# Altium schematic sheet Controller.SchDoc
size A; SheetNumber: 2; SheetTotal: 5
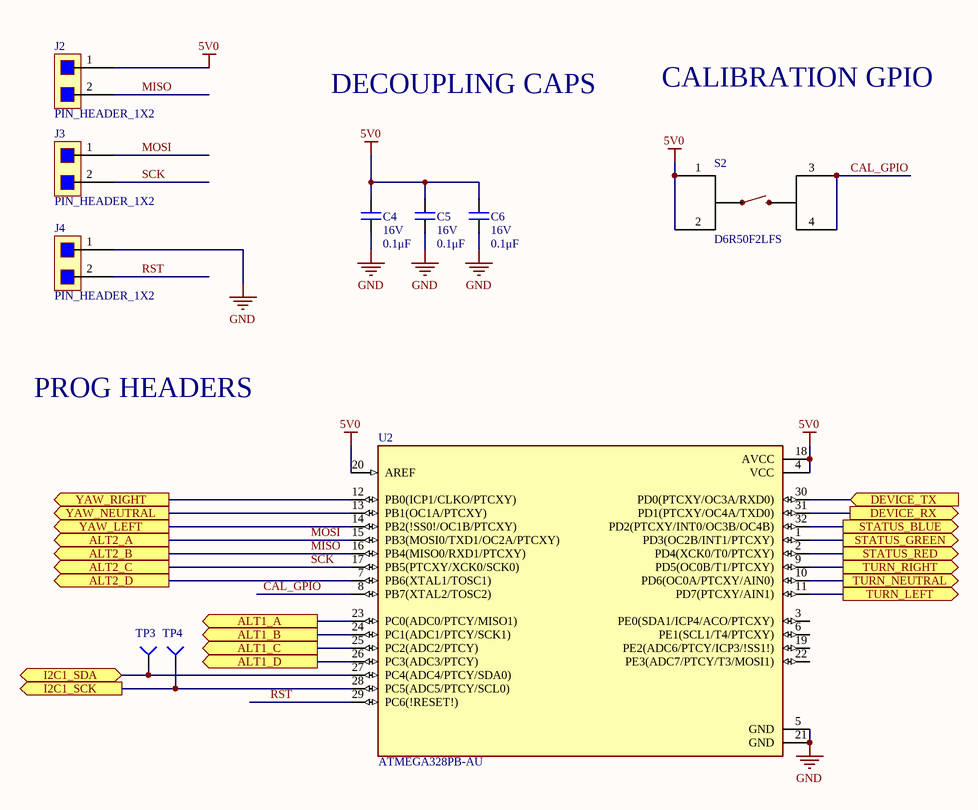
[diagram p0: Controller.SchDoc]

## Parts
C4  value 0.1μF  Voltage Rating: 16V  [CAP0603]  (hidden comment: CAP_0.1uF_16V_0603)
C5  value 0.1μF  Voltage Rating: 16V  [CAP0603]  (hidden comment: CAP_0.1uF_16V_0603)
C6  value 0.1μF  Voltage Rating: 16V  [CAP0603]  (hidden comment: CAP_0.1uF_16V_0603)
J2  PIN_HEADER_1X2  [PIN_HEADER - 1X2]
J3  PIN_HEADER_1X2  [PIN_HEADER - 1X2]
J4  PIN_HEADER_1X2  [PIN_HEADER - 1X2]
S2  Manufacturer Part Number 1: D6R50F2LFS  [D6R]  (hidden comment: SW_MOMENTARY_SPST)
TP3  TESTPT  [TESTPT SQUARE]  (value not drawn)
TP4  TESTPT  [TESTPT SQUARE]  (value not drawn)
U2  ATMEGA328PB-AU  [QFP80P900X900X120-32N]

## Ports
ALT1_A (out), ALT1_B (out), ALT1_C (out), ALT1_D (out), ALT2_A (out), ALT2_B (out), ALT2_C (out), ALT2_D (out), DEVICE_RX (out), DEVICE_TX (in), I2C1_SCK (out), I2C1_SDA (bidir), STATUS_BLUE (out), STATUS_GREEN (out), STATUS_RED (out), TURN_LEFT (out), TURN_NEUTRAL (out), TURN_RIGHT (out), YAW_LEFT (out), YAW_NEUTRAL (out), YAW_RIGHT (out)

## Nets
5V0: C4.2 C5.2 C6.2 J2.1 S2.1 S2.2 U2.4(VCC) U2.18(AVCC) U2.20(AREF)
GND: C4.1 C5.1 C6.1 J4.1 U2.5(GND) U2.21(GND)
ALT1_A: U2.23(PC0(ADC0/PTCY/MISO1)) ; port ALT1_A
ALT1_B: U2.24(PC1(ADC1/PTCY/SCK1)) ; port ALT1_B
ALT1_C: U2.25(PC2(ADC2/PTCY)) ; port ALT1_C
ALT1_D: U2.26(PC3(ADC3/PTCY)) ; port ALT1_D
ALT2_D: U2.7(PB6(XTAL1/TOSC1)) ; port ALT2_D
CAL_GPIO: S2.3 S2.4 U2.8(PB7(XTAL2/TOSC2))
DEVICE_RX: U2.31(PD1(PTCXY/OC4A/TXD0)) ; port DEVICE_RX
DEVICE_TX: U2.30(PD0(PTCXY/OC3A/RXD0)) ; port DEVICE_TX
I2C1_SCK: TP4.1(=value) U2.28(PC5(ADC5/PTCY/SCL0)) ; port I2C1_SCK
I2C1_SDA: TP3.1(=value) U2.27(PC4(ADC4/PTCY/SDA0)) ; port I2C1_SDA
MISO: J2.2 U2.16(PB4(MISO0/RXD1/PTCXY)) ; port ALT2_B
MOSI: J3.1 U2.15(PB3(MOSI0/TXD1/OC2A/PTCXY)) ; port ALT2_A
RST: J4.2 U2.29(PC6(!RESET!))
SCK: J3.2 U2.17(PB5(PTCXY/XCK0/SCK0)) ; port ALT2_C
STATUS_BLUE: U2.32(PD2(PTCXY/INT0/OC3B/OC4B)) ; port STATUS_BLUE
STATUS_GREEN: U2.1(PD3(OC2B/INT1/PTCXY)) ; port STATUS_GREEN
STATUS_RED: U2.2(PD4(XCK0/T0/PTCXY)) ; port STATUS_RED
TURN_LEFT: U2.11(PD7(PTCXY/AIN1)) ; port TURN_LEFT
TURN_NEUTRAL: U2.10(PD6(OC0A/PTCXY/AIN0)) ; port TURN_NEUTRAL
TURN_RIGHT: U2.9(PD5(OC0B/T1/PTCXY)) ; port TURN_RIGHT
YAW_LEFT: U2.14(PB2(!SS0!/OC1B/PTCXY)) ; port YAW_LEFT
YAW_NEUTRAL: U2.13(PB1(OC1A/PTCXY)) ; port YAW_NEUTRAL
YAW_RIGHT: U2.12(PB0(ICP1/CLKO/PTCXY)) ; port YAW_RIGHT

Not connected (* = marked no-connect by the designer): U2 3(PE0(SDA1/ICP4/ACO/PTCXY)) 6(PE1(SCL1/T4/PTCXY)) 19(PE2(ADC6/PTCY/ICP3/!SS1!)) 22(PE3(ADC7/PTCY/T3/MOSI1))

## Notes on the sheet
- DECOUPLING CAPS
- CALIBRATION GPIO
- PROG HEADERS

## Library data of the parts
C4-C6 = CAP_0.1uF_16V_0603: CAP CER 0.1UF 16V X7R 0603; Manufacturer Part Number 1: CC0603KRX7R7BB104; Manufacturer 1: Yageo; Package/Footprint: 0603; Supplier Part Number 1: 311-1088-1-ND; Supplier 1: Digi-Key; Dielectric: X7R
J2-J4 = PIN_HEADER_1X2: Board Connector, 1 Contact(s), 1 Row(s), Male, Straight, Solder Terminal; Manufacturer: Sullins; Manufacturer Part Number: PREC001SAAN-RC; Option: General Purpose; Filter Feature: No; Number of Rows Loaded: 1; Supplier 1: Digi-Key; RoHS: Yes; Category: Connectors; Stock 1: 16681; Pricing 1: 1=0.04000, 10=0.03000, 25=0.02800, 50=0.02080, 100=0.01780, 250=0.01724, 500=0.01486 (USD); Mount: Board; Connector Type: BOARD CONNECTOR; Contact Gender: Male; Mixed Contacts: No; Mounting Style: STRAIGHT; Termination: Solder; Number of Contacts: 1; Flammability Rating: UL94 V-0; DIN Conformance: No; IEC Conformance: No; MIL Conformance: No; ComponentLink1URL: https://datasheet.ciiva.com:443/pdfs/VipMasterIC/IC/SUCS/SUCS-S-A0005121173/SUCS-S-A0005121173-1.pdf?src-supplier=IHS+Markit; ComponentLink1Description: https://datasheet.ciiva.com:443/pdfs/VipMasterIC/IC/SUCS/SUCS-S-A0005121173/SUCS-S-A0005121173-1.pdf?src-supplier=IHS+Markit; ComponentLink2URL: https://datasheet.ciiva.com/740/zrzczzzszzn-rc-st-11635-b-740844.pdf?src-supplier=Digi-Key; ComponentLink2Description: https://datasheet.ciiva.com/740/zrzczzzszzn-rc-st-11635-b-740844.pdf?src-supplier=Digi-Key; Supplier Part Number 1: S1012EC-01-ND
S2 = SW_MOMENTARY_SPST: SWITCH PUSH SPST-NO 0.1A 32V; Manufacturer 1: ITT C&K; Current Rating: 100mA; Throw Configuration: SPST; Operating Force: 2.5N; Actuator Type: Round, Button; Switch Function: Off-Mom; Electrical Life: 250000Cycles; Actuator Length: 7mm; Row Spacing: 5mm; Supplier 1: Digi-Key; Contact Plating: Silver; Number of Terminals: 4; Max Voltage Rating (DC): 32V; Voltage Rating (DC): 32V; Max Current Rating: 100mA; Orientation: Straight; Terminal Pitch: 5mm; Supplier Part Number 1: 401-1993-ND
TP3 TP4 = TESTPT SQUARE
U2 = ATMEGA328PB-AU: RISC Microcontroller, 8-Bit, FLASH, AVR RISC CPU, 20MHz, CMOS, PQFP32; Manufacturer: Microchip; MF: Microchip Technology; Digi-Key_Purchase_URL: https://www.digikey.com/product-detail/en/microchip-technology/ATMEGA328PB-AU/ATMEGA328PB-AU-ND/5638812?utm_source=snapeda&utm_medium=aggregator&utm_campaign=symbol; Digi-Key_Part_Number: ATMEGA328PB-AU-ND; MP: ATMEGA328PB-AU; Value: *; SnapEDA_Link: https://www.snapeda.com/parts/ATMEGA328PB-AU/Microchip/view-part/4478285/?ref=snap; Package: TQFP-32 Microchip Technology; Supplier 1: Digi-Key; Manufacturer Part Number: ATMEGA328PB-AU; RoHS: Yes; Category: Microcontrollers; Pricing 1: 1=1.47000, 25=1.35320, 100=1.23200 (USD); Technology: CMOS; REACH SVHC: Yes; RoHS Compliant: Yes; ComponentLink1URL: https://datasheet.ciiva.com:443/pdfs/VipMasterIC/IC/MCHP/MCHP-S-A0004276582/MCHP-S-A0004276582-1.pdf?src-supplier=IHS+Markit; ComponentLink1Description: https://datasheet.ciiva.com:443/pdfs/VipMasterIC/IC/MCHP/MCHP-S-A0004276582/MCHP-S-A0004276582-1.pdf?src-supplier=IHS+Markit; ComponentLink2URL: http://www.farnell.com/datasheets/2915218.pdf?src-supplier=Farnell; ComponentLink2Description: http://www.farnell.com/datasheets/2915218.pdf?src-supplier=Farnell; ComponentLink3URL: http://www.farnell.com/datasheets/2915218.pdf?src-supplier=Newark; ComponentLink3Description: http://www.farnell.com/datasheets/2915218.pdf?src-supplier=Newark; ComponentLink4URL: http://www.microchip.com/mymicrochip/filehandler.aspx?ddocname=en589666&src-supplier=Digi-Key; ComponentLink4Description: http://www.microchip.com/mymicrochip/filehandler.aspx?ddocname=en589666&src-supplier=Digi-Key; Supplier Part Number 1: ATMEGA328PB-AU-ND